# Altium schematic sheet Audio Amplifier.SchDoc: Audio Amplifier
size Letter; SheetNumber: 4; SheetTotal: 10
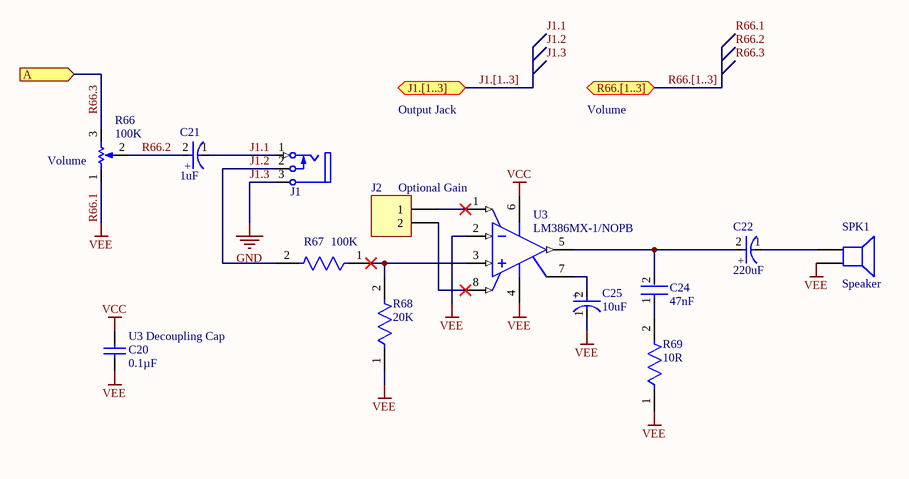
[diagram p0: Audio Amplifier.SchDoc]

## Parts
C20  Capacitance: 0.1µF  [SAMS-C0603-2_M]  (hidden comment: CL10B104KB8NNNC)
C21  Capacitance: 1uF  [FP-OS-CON-SMT-A5-MFG]  (hidden comment: EEE-1HA010NR)
C22  Capacitance: 220uF  [FP-SD-MFG]
C24  Capacitance: 47nF  [FP-CL10-IPC_A]  (hidden comment: CL10B473KB8NNNC)
C25  Capacitance: 10uF  [FP-OS-CON-SMT-A5-MFG]  (hidden comment: 865080440002)
J1  Phonejack2 TN  [JACK/6-V3A]  (value not drawn)  (graphical)
J2  Optional Gain  [HDR1X2]
R66  Volume  value 100K  [VR5]  (graphical)
R67  Resistance: 100K  [FP-ESR03-IPC_B]  (hidden comment: ESR03EZPJ104)
R68  Resistance: 20K  [FP-ESR03-IPC_B]  (hidden comment: ESR03EZPJ203)
R69  Resistance: 10R  [FP-ESR03-IPC_B]  (hidden comment: ESR03EZPJ100)
SPK1  Speaker  [PIN2]
U3  LM386MX-1/NOPB  [TI-D8_L]

## Ports
A (in), J1.[1..3] (bidir), R66.[1..3] (bidir)

## Nets
J1.3: J1.3(S)  [also labelled GND]
R66.1: C20.1 C25.1(C) R66.1(TOP) R68.1 R69.1 SPK1.2 U3.2(IN-) U3.4(GND)  [also labelled VEE]
VCC: C20.2 U3.6(VS)
J1.1: C21.1(C) J1.1(T)
J1.2: J1.2(TN) R67.2
R66.2: C21.2(A) R66.2(TAP)
R66.3: R66.3(BOT) ; port A
NetC22_1: C22.1(C) SPK1.1
NetC22_2: C22.2(A) C24.2 U3.5(VOUT)
NetC24_1: C24.1 R69.2
NetC25_2: C25.2(A) U3.7(BYPASS)
NetJ2_1: J2.1 U3.1(GAIN)
NetJ2_2: J2.2 U3.8(GAIN)
NetR67_1: R67.1 R68.2 U3.3(IN+)

## Buses and harness runs
bus J1.[1..3] = port J1.[1..3]
bus R66.[1..3] = port R66.[1..3]

## Notes on the sheet
- Output Jack
- Volume
- (near C20) U3 Decoupling Cap
- Labels drawn without touching a wire or pin: J1.1, J1.2, J1.3, R66.1, R66.2, R66.3
- (in symbol CMP-05427-000006-1) +
- (in symbol CMP-05427-000158-1) +

## Library data of the parts
C20 = CMP-2000-05332-1: Multi-layer Ceramic Capacitor, -55 to 125 degC, 2-Pin SMD (0603), RoHS, Tape and Reel; Manufacturer: Samsung Electro-Mechanics; Rated Voltage: 50V; Dielectric: X7R; Tolerance (%): ±10%; Case Size/Dimension: 0603; Datasheet URL: https://datasheet.ciiva.com/29198/456651-da-01-en-vs-kondensator-0605-29198839.pdf; Manufacturer URL: http://www.samsungsem.com/global/index.jsp; Datasheet Version: Nov-10
C21 = CMP-05427-000158-1: CAP ALUM POLY 10UF 20% 10V SMD Non-Polarized; Manufacturer: Panasonic; Ripple Current: 700mA; Polarity: Polar; ESR (Equivalent Series Resistance): 220mR; Leakage Current: 50uA; Material: Polymer; Voltage Rating: 50V; Life (Hours): 2000Hour; Dissipation Factor: 10%; Height - Seated (Max): 0.217inch; Height: 5.4mm; Length: 5.4mm; Case/Package: Radial; Number of Pins: 5; Voltage: 10V; Termination: SMD/SMT; Packaging: Tape and Reel; Mount: Surface Mount; Min Operating Temperature: -55°C; Voltage Rating (DC): 10V; Construction: Cylindrical; Series: OS-CON™, SVP; Max Operating Temperature: 105°C; Radiation Hardening: No; Diameter: 4mm; REACH SVHC: No SVHC; Ripple Current (AC): 700mA; RoHS Compliant: Yes; Tolerance: 20%; Package Quantity: 2000; Lead Free: Lead Free; Supplier 1: Mouser; Supplier Part Number 1: 667-EEE-1HA010NR; Manufacturer Part Number: EEE-1HA010NR; RoHS: Yes; Category: Aluminum Electrolytic Capacitors; Stock 1: 106; Pricing 1: 1=0.49000, 10=0.33900, 50=0.23700, 100=0.20300, 1000=0.15300, 10000=0.12100 (USD); Contact Plating: Tin; Width: 650um; ComponentLink1URL: https://datasheet.ciiva.com/24228/aba0000ce2-40801-24228231.pdf?src-supplier=Mouser; ComponentLink1Description: https://datasheet.ciiva.com/24228/aba0000ce2-40801-24228231.pdf?src-supplier=Mouser; ComponentLink2URL: https://datasheet.ciiva.com/14604/70255710-14604079.pdf?src-supplier=Allied+Electronics; ComponentLink2Description: https://datasheet.ciiva.com/14604/70255710-14604079.pdf?src-supplier=Allied+Electronics; ComponentLink3URL: https://datasheet.ciiva.com/14597/70255710-14597097.pdf?src-supplier=Allied+Electronics; ComponentLink3Description: https://datasheet.ciiva.com/14597/70255710-14597097.pdf?src-supplier=Allied+Electronics; ComponentLink4URL: https://datasheet.ciiva.com/16396/aba0000ce2-16396566.pdf?src-supplier=Future+Electronics; ComponentLink4Description: https://datasheet.ciiva.com/16396/aba0000ce2-16396566.pdf?src-supplier=Future+Electronics; ComponentLink5URL: https://datasheet.ciiva.com/30244/11aba0000ce2-30244199.pdf?src-supplier=Onlinecomponents.com; ComponentLink5Description: https://datasheet.ciiva.com/30244/11aba0000ce2-30244199.pdf?src-supplier=Onlinecomponents.com
C22 = CMP-05427-000006-1: Manufacturer: Nichicon; Manufacturer Part Number: UCL1C221MCL1GS; Material: Aluminium; Tolerance: 20%; Voltage Rating: 16V; Ripple Current: 600mA; Impedance: 160mR; Leakage Current: 3uA; Life (Hours): 2000Hour; Dissipation Factor: 0.16%; Supplier 1: Arrow Electronics; Supplier Part Number 1: UCL1C221MCL1GS; RoHS: Yes; Category: Aluminum Electrolytic Capacitors; Stock 1: 77400; Pricing 1: 900=0.22420 (USD); Mount: Surface Mount; Case/Package: Radial; Number of Pins: 2; Dielectric Material: Aluminium; Min Operating Temperature: -55°C; Max Operating Temperature: 105°C; Package Quantity: 1; Packaging: Tape and Reel; Voltage Rating (DC): 16V; Termination: SMD/SMT; Ripple Current (AC): 600mA; ESR (Equivalent Series Resistance): 160mR; Series: CL; Construction: Cylindrical; Diameter: 6.3mm; Length: 7.7mm; Height: 7.7mm; Height - Seated (Max): 0.303inch; Radiation Hardening: No; REACH SVHC: No SVHC; Lead Free: Lead Free; RoHS Compliant: Yes; ComponentLink1URL: https://datasheet.ciiva.com/101/e-cl-101761.pdf?src-supplier=Digi-Key; ComponentLink1Description: https://datasheet.ciiva.com/101/e-cl-101761.pdf?src-supplier=Digi-Key; ComponentLink2URL: https://datasheet.ciiva.com/101/e-cl-101762.pdf?src-supplier=Digi-Key; ComponentLink2Description: https://datasheet.ciiva.com/101/e-cl-101762.pdf?src-supplier=Digi-Key; ComponentLink3URL: https://datasheet.ciiva.com/101/e-cl-101763.pdf?src-supplier=Digi-Key; ComponentLink3Description: https://datasheet.ciiva.com/101/e-cl-101763.pdf?src-supplier=Digi-Key; ComponentLink4URL: https://datasheet.ciiva.com/11684/e-cl-11684891.pdf?src-supplier=Avnet; ComponentLink4Description: https://datasheet.ciiva.com/11684/e-cl-11684891.pdf?src-supplier=Avnet; ComponentLink5URL: https://datasheet.ciiva.com/16502/e-cl-16502283.pdf?src-supplier=Future+Electronics; ComponentLink5Description: https://datasheet.ciiva.com/16502/e-cl-16502283.pdf?src-supplier=Future+Electronics
C24 = CMP-13271-001056-1: Cap Ceramic 47nF 50V X7R ±10% Pad SMD 0603 +125°C T/R; Dielectric: Y5V; Packaging: Tape and Reel; Material: Ceramic; Max Operating Temperature: 125°C; Case/Package: 0603; Voltage Rating: 50V; Tolerance: 10%; Voltage: 50V; Height: 0.8mm; Mount: Surface Mount; Min Operating Temperature: -55°C; Package Quantity: 4000; Length: 1.6mm; Depth: 0.8mm; Lead Free: Lead Free; Case Code (Metric): 1608; Width: 0.031inch; Thickness: 0.035inch; Case Code (Imperial): 0603; Radiation Hardening: No; Voltage Rating (DC): 50V; Contact Plating: Tin
C25 = CMP-05427-000158-1: CAP ALUM POLY 10UF 20% 10V SMD; Manufacturer: Wurth Electronics; Voltage Rating: 25V; Polarity: Polar; Ripple Current: 85mA; Impedance: 2.1R; Life (Hours): 2000Hour; Supplier 1: RSComponents; Supplier Part Number 1: 8391799P; Manufacturer Part Number: 865080440002; RoHS: Yes; Category: Aluminum Electrolytic Capacitors; Stock 1: 1; Pricing 1: 25=0.18500, 125=0.12700, 250=0.11600, 500=0.10400 (USD); Mount: Surface Mount; Case/Package: Radial; Min Operating Temperature: -55°C; Max Operating Temperature: 105°C; Package Quantity: 2000; Packaging: Cut Tape; Ripple Current (AC): 85mA; Tolerance: 20%; Voltage Rating (DC): 25V; Diameter: 4mm; Height: 5.5mm; Height - Seated (Max): 0.217inch; REACH SVHC: Unknown; RoHS Compliant: Yes; ComponentLink1URL: http://www.farnell.com/datasheets/1880137.pdf?src-supplier=Farnell; ComponentLink1Description: http://www.farnell.com/datasheets/1880137.pdf?src-supplier=Farnell; ComponentLink2URL: http://www.farnell.com/datasheets/1880137.pdf?src-supplier=Element14; ComponentLink2Description: http://www.farnell.com/datasheets/1880137.pdf?src-supplier=Element14; ComponentLink3URL: https://katalog.we-online.de/pbs/datasheet/865080440002.pdf?src-supplier=Digi-Key; ComponentLink3Description: https://katalog.we-online.de/pbs/datasheet/865080440002.pdf?src-supplier=Digi-Key; ComponentLink4URL: http://katalog.we-online.de/pbs/datasheet/865080440002.pdf?src-supplier=Digi-Key; ComponentLink4Description: http://katalog.we-online.de/pbs/datasheet/865080440002.pdf?src-supplier=Digi-Key
J1 = Phonejack2 TN: Jack Socket, 1/4" [6.5mm], Thru-Hole, Vertical, 2-Conductor with Tip closed; PackageDocument: 2003; PCB_Layout: Complies with manufacturer's recommendation.; DrillAndSlotSize: Corresponds to nominal value.; ComponentLink1URL: http://www.cliffuk.co.uk/; ComponentLink1Description: Manufacturer Link; LatestRevisionDate: 15-Jul-2004; LatestRevisionNote: Component Replaced & renamed from "Phonejack".; DatasheetDocument: 2003; PackageReference: S1VS_SNB; Publisher: Altium Limited
J2 = Header 2: Header, 2-Pin; LatestRevisionDate: 17-Jul-2002; LatestRevisionNote: Re-released for DXP Platform.; Publisher: Altium Limited
R66 = RPot: Potentiometer; Sim Note: Enter the Resistance value and the set point into parameter fields.; Set Position: 0.5; Published: 8-Jun-2000; LatestRevisionDate: 17-Jul-2002; LatestRevisionNote: Re-released for DXP Platform.; PackageReference: VR5; Publisher: Altium Limited; PackageDescription: Variable Resistor, Thru-Hole; 3 Leads
R67 = CMP-08839-029521-1: 100kΩ ±5% 0.25W 0603 Anti-Surge Chip Resistor AEC-Q200; Power Rating: 200mW; Max Power Dissipation: 250mW; Temperature Coefficient: 200ppm/°C; Length: 0.063inch; Case Code (Imperial): 0603; Case/Package: 0603; Resistor Type: Thick Film; Features: Automotive AEC-Q200; Package Quantity: 1; Width: 0.031inch; Packaging: Cut Tape; Min Operating Temperature: -55°C; Series: ESR; RoHS Compliant: Yes; Size Code: 0603; Tolerance: 5%; Height: 0.022inch; Max Operating Temperature: 155°C; Lead Free: Lead Free; Case Code (Metric): 1608; Number of Terminations: 2
R68 = CMP-08839-028532-1: 20kΩ ±5% 0.25W 0603 Anti-Surge Chip Resistor AEC-Q200; Temperature Coefficient: 200ppm/°C; Max Power Dissipation: 250mW; Resistor Type: Thick Film; Number of Terminations: 2; Height: 0.022inch; Package Quantity: 5000; Case/Package: 0603; Packaging: Cut Tape; Case Code (Imperial): 0603; Width: 0.031inch; Max Operating Temperature: 155°C; Length: 0.063inch; Features: Automotive AEC-Q200; Case Code (Metric): 1608; Tolerance: 5%; Series: ESR; Min Operating Temperature: -55°C
R69 = CMP-08839-028230-1: 10Ω ±5% 0.25W 0603 Anti-Surge Chip Resistor AEC-Q200; Max Power Dissipation: 250mW; Temperature Coefficient: 200ppm/°C; Features: Automotive AEC-Q200; Packaging: Tape and Reel; Series: ESR; Tolerance: 5%; Min Operating Temperature: -55°C; Case Code (Imperial): 0603; RoHS Compliant: Yes; Resistor Type: Thick Film; Case/Package: 0603; Max Operating Temperature: 155°C; Number of Terminations: 2; Case Code (Metric): 1608
SPK1 = Speaker: Loudspeaker; Published: 24-Mar-1999; LatestRevisionDate: 17-Jul-2002; LatestRevisionNote: Re-released for DXP Platform.; PackageReference: PIN2; Publisher: Altium Limited
U3 = CMP-0994-00003-1: Low Voltage Audio Power Amplifier, 0 to 70 degC, 8-pin SOIC (D8), Green (RoHS & no Sb/Br); Manufacturer: Texas Instruments; SubFamily: Mid/High-Power Amplifier; Max. Number of Speaker Outputs: 1; Input Type: Analog; Mounting Technology: Surface Mount; ComponentLink1Description: Manufacturer URL; PackageVersion: 4040047-3/M, 06/2011; ComponentLink2URL: http://www.ti.com/general/docs/lit/getliterature.tsp?genericPartNumber=LM386&fileType=pdf; ComponentLink1URL: http://www.ti.com/; PackageDescription: 8-Pin Plastic Small Outline, Body 4.9 x 3.9 mm, Pitch 1.27 mm; PartNumber: LM386MX-1/NOPB; ComponentLink3Description: Package Specification; Eco-Plan: Green (RoHS & no Sb/Br); DatasheetVersion: SNAS545A; Code_JEDEC: MS-012; ComponentLink3URL: http://www.ti.com/litv/pdf/msoi002j; ComponentLink2Description: Datasheet; PackageReference: D8